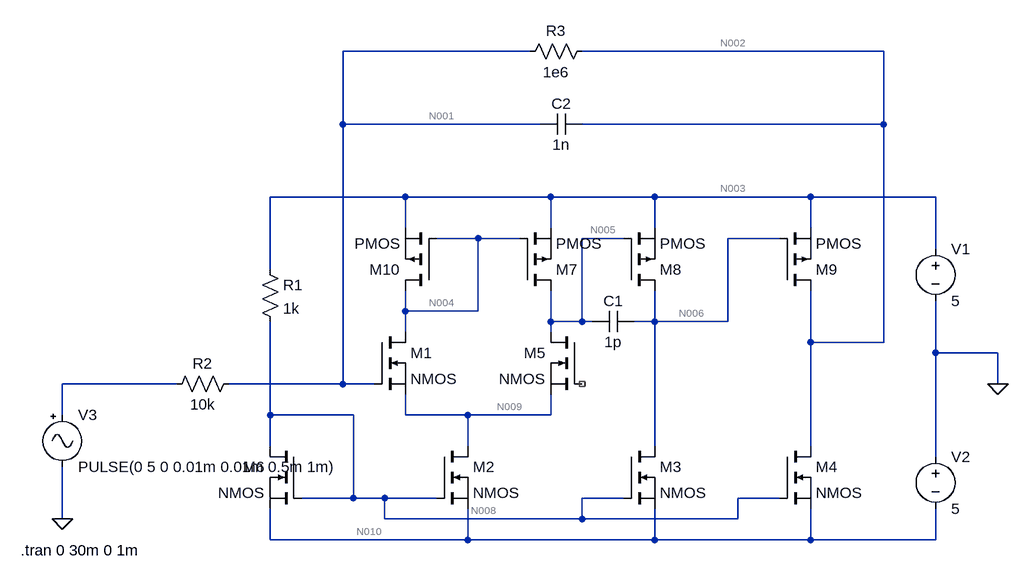
[diagram p0: schematic cm_opamp.asc]
cm_opamp.asc, the LTspice schematic file:
Version 4
SHEET 1 1780 680
WIRE 448 -256 160 -256
WIRE 992 -256 528 -256
WIRE 160 -144 160 -256
WIRE 464 -144 160 -144
WIRE 992 -144 992 -256
WIRE 992 -144 528 -144
WIRE 256 -32 48 -32
WIRE 480 -32 256 -32
WIRE 640 -32 480 -32
WIRE 880 -32 640 -32
WIRE 1072 -32 880 -32
WIRE 256 16 256 -32
WIRE 480 16 480 -32
WIRE 640 16 640 -32
WIRE 880 16 880 -32
WIRE 368 32 304 32
WIRE 432 32 368 32
WIRE 592 32 528 32
WIRE 832 32 752 32
WIRE 1072 48 1072 -32
WIRE 48 80 48 -32
WIRE 256 144 256 112
WIRE 368 144 368 32
WIRE 368 144 256 144
WIRE 480 160 480 112
WIRE 528 160 528 32
WIRE 528 160 480 160
WIRE 544 160 528 160
WIRE 640 160 640 112
WIRE 640 160 608 160
WIRE 752 160 752 32
WIRE 752 160 640 160
WIRE 256 176 256 144
WIRE 480 176 480 160
WIRE 880 192 880 112
WIRE 992 192 992 -144
WIRE 992 192 880 192
WIRE 1072 208 1072 128
WIRE 1168 208 1072 208
WIRE -96 256 -272 256
WIRE 160 256 160 -144
WIRE 160 256 -16 256
WIRE 208 256 160 256
WIRE 1168 256 1168 208
WIRE -272 304 -272 256
WIRE 48 304 48 160
WIRE 176 304 48 304
WIRE 256 304 256 272
WIRE 352 304 256 304
WIRE 480 304 480 272
WIRE 480 304 352 304
WIRE 48 352 48 304
WIRE 352 352 352 304
WIRE 640 352 640 160
WIRE 880 352 880 192
WIRE 1072 368 1072 208
WIRE 176 432 176 304
WIRE 176 432 96 432
WIRE 224 432 176 432
WIRE 304 432 224 432
WIRE 592 432 528 432
WIRE 832 432 768 432
WIRE -272 464 -272 384
WIRE 224 464 224 432
WIRE 528 464 528 432
WIRE 528 464 224 464
WIRE 768 464 768 432
WIRE 768 464 528 464
WIRE 48 496 48 448
WIRE 352 496 352 448
WIRE 352 496 48 496
WIRE 640 496 640 448
WIRE 640 496 352 496
WIRE 880 496 880 448
WIRE 880 496 640 496
WIRE 1072 496 1072 448
WIRE 1072 496 880 496
FLAG -272 464 0
FLAG 1168 256 0
SYMBOL nmos 208 176 R0
SYMATTR InstName M1
SYMBOL nmos 304 352 R0
SYMATTR InstName M2
SYMBOL nmos 592 352 R0
SYMATTR InstName M3
SYMBOL nmos 832 352 R0
SYMATTR InstName M4
SYMBOL nmos 528 176 M0
SYMATTR InstName M5
SYMBOL nmos 96 352 M0
SYMATTR InstName M6
SYMBOL pmos 432 112 M180
SYMATTR InstName M7
SYMBOL pmos 592 112 M180
SYMATTR InstName M8
SYMBOL pmos 832 112 M180
SYMATTR InstName M9
SYMBOL pmos 304 112 R180
SYMATTR InstName M10
SYMBOL cap 608 144 R90
WINDOW 0 0 32 VBottom 2
WINDOW 3 32 32 VTop 2
SYMATTR InstName C1
SYMATTR Value 1p
SYMBOL res 32 64 R0
SYMATTR InstName R1
SYMATTR Value 1k
SYMBOL voltage 1072 32 R0
WINDOW 123 0 0 Left 0
WINDOW 39 0 0 Left 0
SYMATTR InstName V1
SYMATTR Value 5
SYMBOL voltage 1072 352 R0
WINDOW 123 0 0 Left 0
WINDOW 39 0 0 Left 0
SYMATTR InstName V2
SYMATTR Value 5
SYMBOL res 0 240 R90
WINDOW 0 0 56 VBottom 2
WINDOW 3 32 56 VTop 2
SYMATTR InstName R2
SYMATTR Value 10k
SYMBOL cap 528 -160 R90
WINDOW 0 0 32 VBottom 2
WINDOW 3 32 32 VTop 2
SYMATTR InstName C2
SYMATTR Value 1n
SYMBOL res 544 -272 R90
WINDOW 0 0 56 VBottom 2
WINDOW 3 32 56 VTop 2
SYMATTR InstName R3
SYMATTR Value 1e6
SYMBOL Misc\\signal -272 288 R0
WINDOW 123 0 0 Left 0
WINDOW 39 0 0 Left 0
SYMATTR InstName V3
SYMATTR Value PULSE(0 5 0 0.01m 0.01m 0.5m 1m)
TEXT -336 512 Left 2 !.tran 0 30m 0 1m

The netlist it stands for:
* cm_opamp.asc
M1 N004 N001 N009 N009 NMOS
M2 N009 N008 N010 N010 NMOS
M3 N006 N008 N010 N010 NMOS
M4 N002 N008 N010 N010 NMOS
M5 N005 NC_01 N009 N009 NMOS
M6 N008 N008 N010 N010 NMOS
M7 N005 N004 N003 N003 PMOS
M8 N006 N005 N003 N003 PMOS
M9 N002 N006 N003 N003 PMOS
M10 N004 N004 N003 N003 PMOS
C1 N006 N005 1p
R1 N003 N008 1k
V1 N003 0 5
V2 0 N010 5
R2 N001 N007 10k
C2 N002 N001 1n
R3 N002 N001 1e6
V3 N007 0 PULSE(0 5 0 0.01m 0.01m 0.5m 1m)
.model NMOS NMOS
.model PMOS PMOS
.lib standard.mos
.tran 0 30m 0 1m
.backanno
.end

* Results of the author's LTspice run, read from the files saved beside the schematic
* Operating Point, zero values left out:
*   V(n004) = 1.478 V
*   V(n001) = -5.026 mV
*   V(n009) = -3.527 V
*   V(n008) = 4.161 V
*   V(n010) = -5 V
*   V(n006) = -3.389 V
*   V(n002) = -507.7 mV
*   V(n005) = -188.2 mV
*   V(n003) = 5 V
*   Id(M10) = -124.1 µA
*   Ib(M10) = 3.532 pA
*   Is(M10) = 124.1 µA
*   Id(M9) = -620.8 µA
*   Ib(M9) = 5.518 pA
*   Is(M9) = 620.8 µA
*   Id(M8) = -269.2 µA
*   Ib(M8) = 8.399 pA
*   Is(M8) = 269.2 µA
*   Id(M7) = -124.1 µA
*   Ib(M7) = 5.198 pA
*   Is(M7) = 124.1 µA
*   Id(M6) = 839.2 µA
*   Ib(M6) = -9.171 pA
*   Is(M6) = -839.2 µA
*   Id(M5) = 124.1 µA
*   Ib(M5) = -3.349 pA
*   Is(M5) = -124.1 µA
*   Id(M4) = 621.3 µA
*   Ib(M4) = -4.502 pA
*   Is(M4) = -621.3 µA
*   Id(M3) = 269.2 µA
*   Ib(M3) = -1.621 pA
*   Is(M3) = -269.2 µA
*   Id(M2) = 248.1 µA
*   Ib(M2) = -1.483 pA
*   Is(M2) = -248.1 µA
*   Id(M1) = 124.1 µA
*   Ib(M1) = -5.015 pA
*   Is(M1) = -124.1 µA
*   I(R3) = -502.6 nA
*   I(R2) = -502.6 nA
*   I(R1) = 839.2 µA
*   I(V3) = -502.6 nA
*   I(V2) = -1.978 mA
*   I(V1) = -1.977 mA